# EAGLE design fio_proto_shield (EAGLE 5.02)
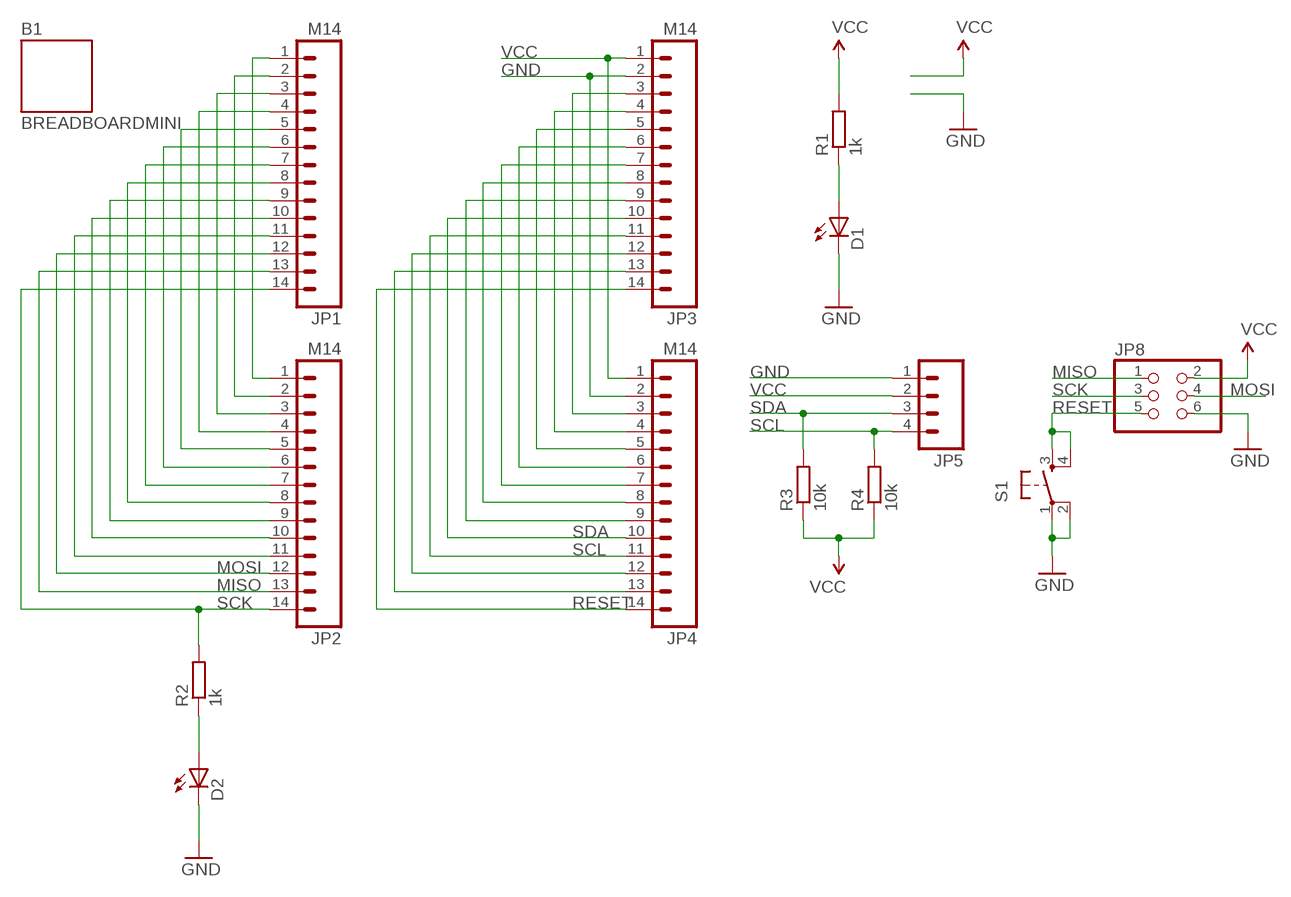
[diagram p0: schematic, sheet 1]

## Parts
B1  BREADBOARDMINI  [BREADBOARD-MINI]
D1  LED3MM  [LED3MM]
D2  LED3MM  [LED3MM]
JP1  M14  [1X14]
JP2  M14  [1X14]
JP3  M14  [1X14]
JP4  M14  [1X14]
JP5  M04PTH  [1X04]
JP8  PINHD-2X3  [2X03]
R1  1k  R-EU_0204/5  [0204/5]
R2  1k  R-EU_0204/5  [0204/5]
R3  10k  R-EU_0204/5  [0204/5]
R4  10k  R-EU_0204/5  [0204/5]
S1  TAC_SWITCHPTH  [TACTILE-PTH]

## Nets
GND: D1.K(C) D2.K(C) JP1.2 JP2.2 JP3.2 JP4.2 JP5.1 JP8.6 S1.1 S1.2
MISO: JP1.13 JP2.13 JP8.1
MOSI: JP1.12 JP2.12 JP8.4
N$3: JP1.3 JP2.3
N$4: JP1.4 JP2.4
N$5: JP1.5 JP2.5
N$6: JP1.6 JP2.6
N$7: JP1.7 JP2.7
N$8: JP1.8 JP2.8
N$9: JP1.9 JP2.9
N$10: JP1.10 JP2.10
N$11: JP1.11 JP2.11
N$12: D1.A R1.1
N$13: D2.A R2.1
N$17: JP3.3 JP4.3
N$18: JP3.4 JP4.4
N$19: JP3.5 JP4.5
N$20: JP3.6 JP4.6
N$21: JP3.7 JP4.7
N$22: JP3.8 JP4.8
N$23: JP3.9 JP4.9
N$26: JP3.12 JP4.12
N$27: JP3.13 JP4.13
RESET: JP3.14 JP4.14 JP8.5 S1.3 S1.4
SCK: JP1.14 JP2.14 JP8.3 R2.2
SCL: JP3.11 JP4.11 JP5.4 R4.2
SDA: JP3.10 JP4.10 JP5.3 R3.2
VCC: JP1.1 JP2.1 JP3.1 JP4.1 JP5.2 JP8.2 R1.2 R3.1 R4.1

## Library data of the parts
B1 = SparkFun:BREADBOARD: Breadboard Mini Self Adhesive This is the mechnical outline for the very small self adhesive breadboard from SparkFun Electronics. Good for very small proto areas. SKU : PRT-07916
D1 D2 = SparkFun:LED: LEDs Standard schematic elements and footprints for 5mm, 3mm, 1206, and 0603 sized LEDs. 5mm - Spark Fun Electronics SKU : COM-00529 (and others)
JP1-JP4 = SparkFun:M14: Header 14 Standard 14-pin 0.1" header. Use with straight break away headers (SKU : PRT-00116), right angle break away headers (PRT-00553), swiss pins (PRT-00743), machine pins (PRT-00117), and female headers (PRT-00115).
JP5 = SparkFun:M04: Header 4 Standard 4-pin 0.1" header. Use with straight break away headers (SKU : PRT-00116), right angle break away headers (PRT-00553), swiss pins (PRT-00743), machine pins (PRT-00117), and female headers (PRT-00115). Molex polarized connector foot print use with SKU : PRT-08231 with associated crimp pins and housings.
JP8 = pinhead:PINHD-2X3: PIN HEADER
R1-R4 = rcl:R-EU_: RESISTOR, European symbol
S1 = SparkFun:TAC_SWITCH: Momentary Switch Button commonly used for reset or general input. Spark Fun Electronics SKU : COM-00097

## Board
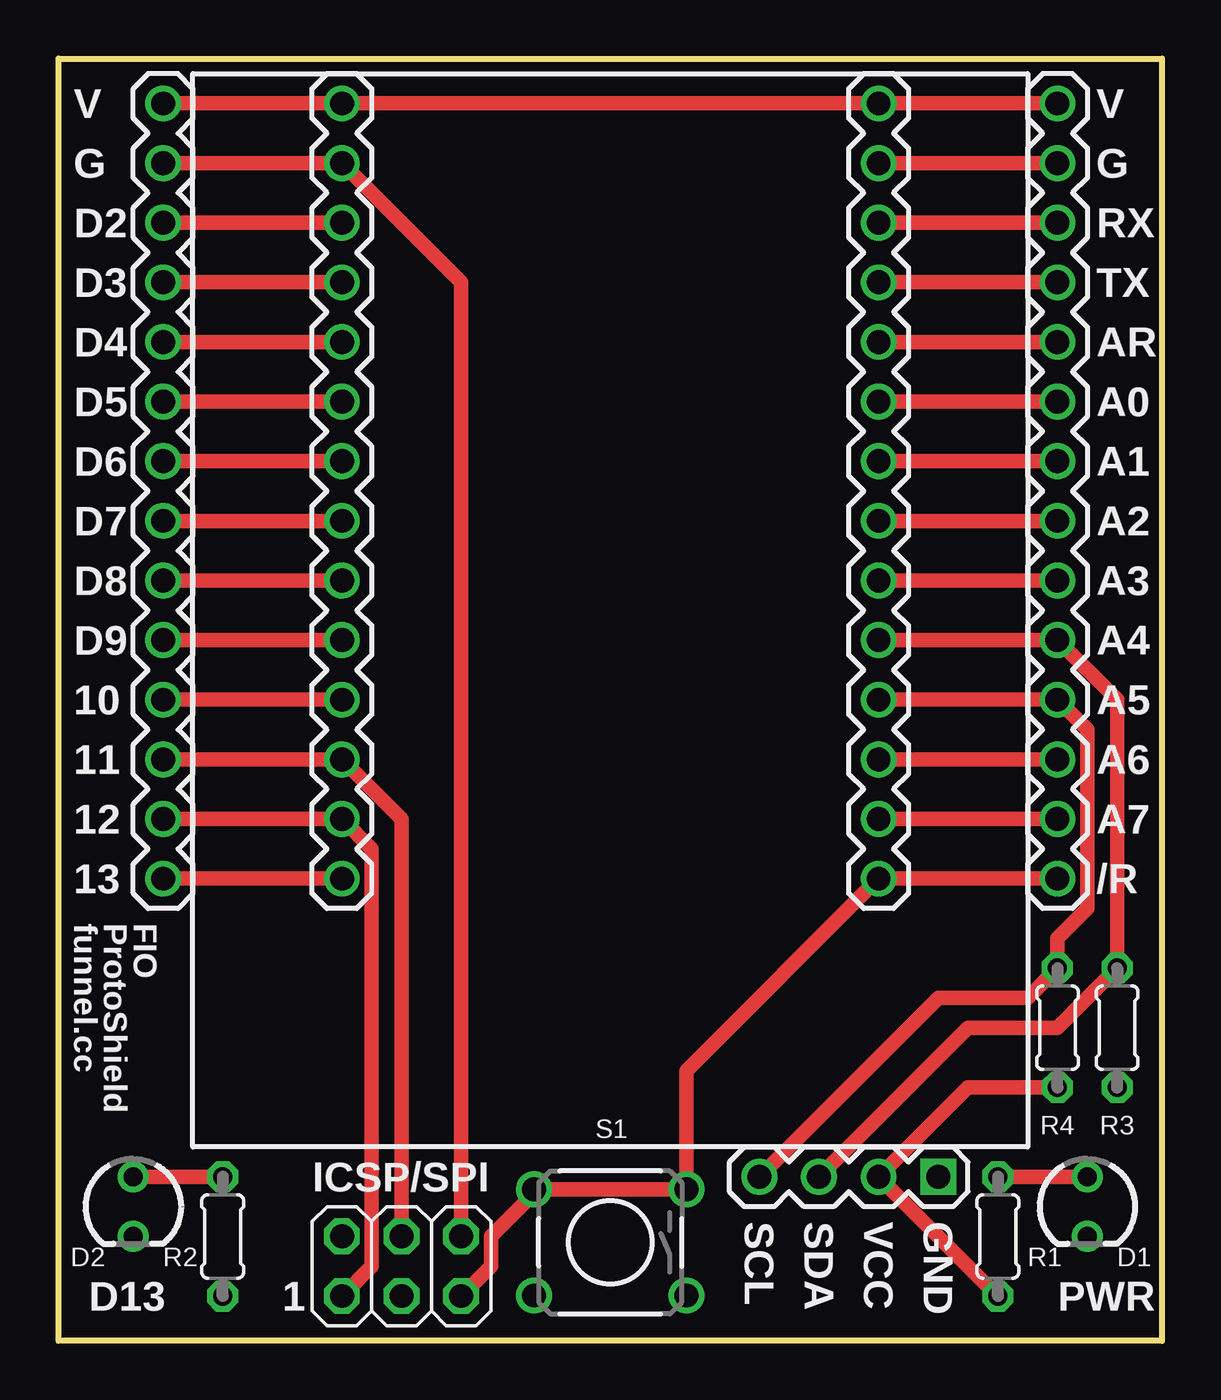
[diagram p1: board, top side]
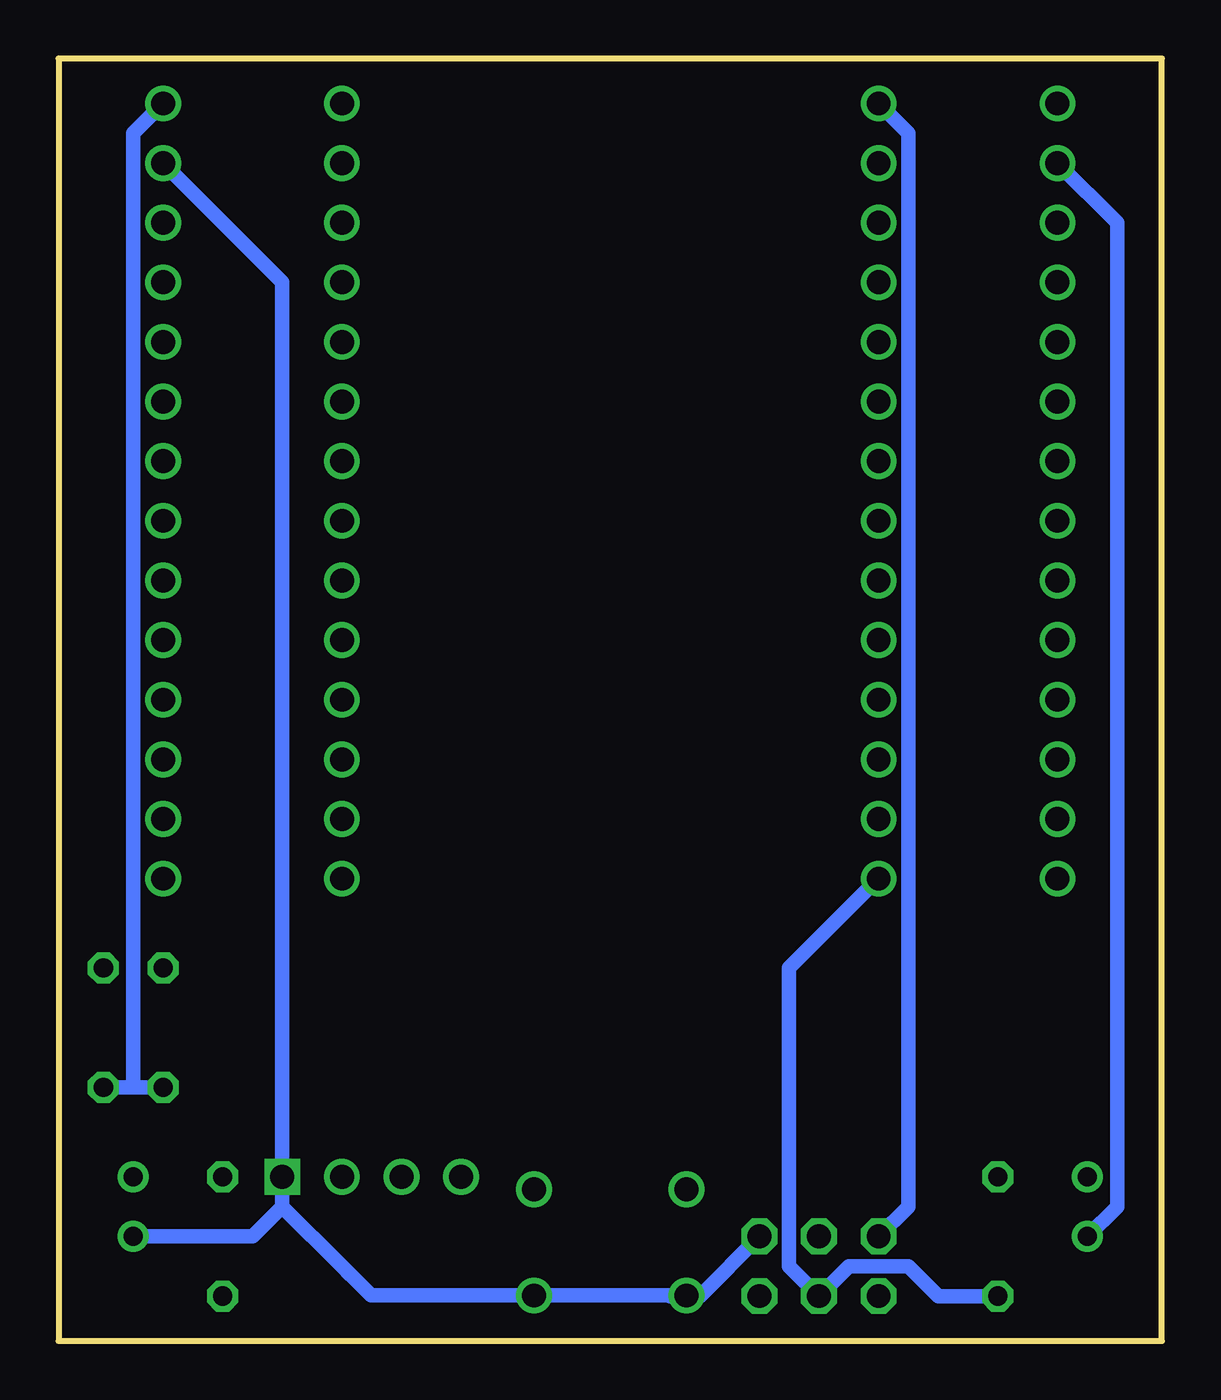
[diagram p2: board, bottom side, seen from below]

Size 46.99 x 54.61 mm. Coordinates in mm from the lower left corner, seen from the top.
Outline: 0,0 0,54.61 46.99,54.61 46.99,0 0,0
Copper layers (1*16): Top 0.035mm / dielectric 1.5mm / Bottom 0.035mm
Design rules "default": minimum track width 10mil, minimum drill 24mil, track to track 8mil, track to pad 8mil, pad to pad 8mil, via to via 8mil, smd to smd 8mil, copper to edge 40mil, drill to drill 8mil, minimum pad ring 10mil, minimum via ring 8mil, stop-mask expansion 4mil, vias tented up to drill 0mil, thermal gap 10mil

### Footprints (pad centres in the part's own frame; a part is rotated, then mirrored left to right if it is on the bottom)
LED3MM = drill 0.813 round: A -1.27,0; K 1.27,0
1X14 = drill 1.016 round: 1 0,0; 2 2.54,0; 3 5.08,0; 4 7.62,0; 5 10.16,0; 6 12.7,0; 7 15.24,0; 8 17.78,0; 9 20.32,0; 10 22.86,0; 11 25.4,0; 12 27.94,0; 13 30.48,0; 14 33.02,0
1X04 = drill 1.016 square: 1 0,0 | drill 1.016 round: 2 2.54,0; 3 5.08,0; 4 7.62,0
2X03 = drill 1.016 octagon: 1 -2.54,-1.27; 2 -2.54,1.27; 3 0,-1.27; 4 0,1.27; 5 2.54,-1.27; 6 2.54,1.27
0204/5 = drill 0.813 octagon: 1 -2.54,0; 2 2.54,0
TACTILE-PTH = drill 1.016 round: 1 -3.251,2.261; 2 3.251,2.261; 3 -3.251,-2.261; 4 3.251,-2.261

### Placement (x,y rotation side)
B1  5.71,53.98 270 top
D1  43.82,5.71 270 top
D2  3.17,5.71 270 top
JP1  12.06,52.71 270 top
JP2  4.45,52.71 270 top
JP3  34.93,52.71 270 top
JP4  42.55,52.71 270 top
JP5  37.47,6.99 180 top
JP8  14.61,3.17 0 top
R1  40.01,4.45 270 top
R2  6.99,4.45 270 top
R3  4.7k  [0204/5]  45.09,13.34 90 top
R4  4.7k  [0204/5]  42.55,13.34 90 top
S1  23.49,4.19 180 top

### Tracks (layer width: path | path; a pad name or v marks a point on that pad's centre or on a via)
GND
  Top 0.61: JP4.2 JP3.2 | JP2.2 JP1.2 17.14,45.09 JP8.6
  Bottom 0.61: JP4.2 37.47,45.09 JP5.1 37.47,5.71 | 37.47,5.71 38.73,4.45 D1.K | 34.93,3.17 34.57,2.82 | 34.93,3.17 37.47,5.71 | 27.3,1.93 S1.1 | 27.3,1.93 33.68,1.93 34.93,3.17 | 27.3,1.93 27.3,1.91 27.28,1.93 20.95,1.93 | 20.95,1.93 S1.2 | JP8.6 19.68,1.91 20.95,1.91 20.95,1.93 | D2.K 1.91,5.71 1.91,47.62 JP2.2
MISO
  Top 0.61: JP2.13 JP1.13 13.34,20.95 13.34,3.17 JP8.1
MOSI
  Top 0.61: JP2.12 JP1.12 14.61,22.22 JP8.4
N$3
  Top 0.61: JP2.3 JP1.3
N$4
  Top 0.61: JP2.4 JP1.4
N$5
  Top 0.61: JP2.5 JP1.5
N$6
  Top 0.61: JP2.6 JP1.6
N$7
  Top 0.61: JP2.7 JP1.7
N$8
  Top 0.61: JP2.8 JP1.8
N$9
  Top 0.61: JP2.9 JP1.9
N$10
  Top 0.61: JP2.10 JP1.10
N$11
  Top 0.61: JP2.11 JP1.11
N$12
  Top 0.61: R1.1 D1.A
N$13
  Top 0.61: D2.A R2.1
N$17
  Top 0.61: JP3.3 JP4.3
N$18
  Top 0.61: JP3.4 JP4.4
N$19
  Top 0.61: JP3.5 JP4.5
N$20
  Top 0.61: JP3.6 JP4.6
N$21
  Top 0.61: JP3.7 JP4.7
N$22
  Top 0.61: JP3.8 JP4.8
N$23
  Top 0.61: JP3.9 JP4.9
N$26
  Top 0.61: JP3.12 JP4.12
N$27
  Top 0.61: JP3.13 JP4.13
RESET
  Top 0.61: JP4.14 JP3.14 26.75,11.51 S1.3 26.75,6.43 26.67,6.35 26.57,6.45 S1.4 20.24,6.43 20.32,6.35 18.41,4.45 18.41,3.17 JP8.5
SCK
  Top 0.61: JP1.14 JP2.14
  Bottom 0.61: JP1.14 15.88,15.88 15.88,3.17 JP8.3 13.34,3.17 10.79,3.17 9.53,1.91 R2.2
SCL
  Top 0.61: JP3.11 JP4.11 43.82,26.04 43.82,18.41 42.55,17.14 R4.2 41.27,14.61 37.47,14.61 JP5.4
SDA
  Top 0.61: JP3.10 JP4.10 45.09,27.3 R3.2 42.55,13.34 38.73,13.34 JP5.3
VCC
  Top 0.61: JP4.1 JP3.1 JP1.1 JP2.1 | R1.2 JP5.2 38.73,10.79 R4.1
  Bottom 0.61: JP4.1 43.82,51.44 43.82,10.79 | 43.82,10.79 R3.1 | 43.82,10.79 R4.1 | JP8.2 10.79,5.71 10.79,51.44 JP1.1

### Text on the board
tPlace: V | V | G | G | D2 | RX | D3 | TX | D4 | AR | D5 | A0 | D6 | A1 | D7 | A2 | D8 | A3 | D9 | A4 | 10 | A5 | 11 | A6 | 12 | A7 | 13 | /R | funnel.cc | ProtoShield | FIO | ICSP/SPI | SCL | SDA | VCC | GND | D13 | 1 | PWR